# Altium schematic sheet RTC.SchDoc
size A3; SheetNumber: 16; SheetTotal: 23
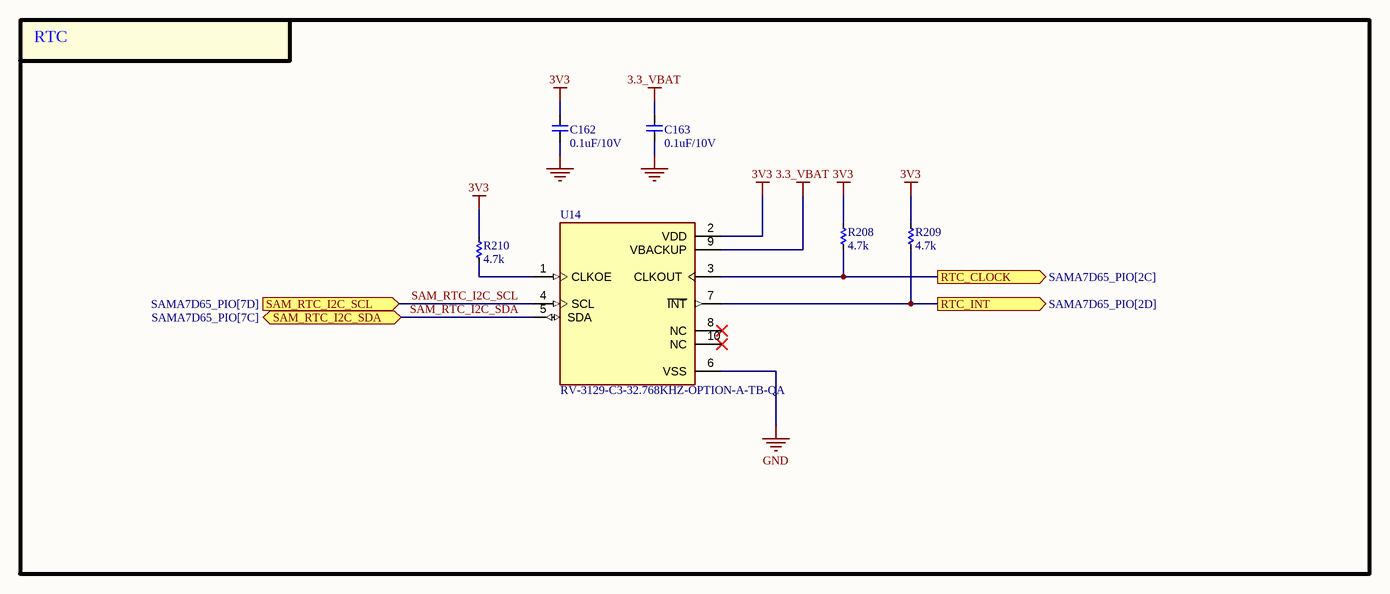
[diagram p0: RTC.SchDoc]

## Parts
C162  0.1uF/10V  [CAP_C_1005X50_L]
C163  0.1uF/10V  [CAP_C_1005X50_L]
R208  4.7k  [RES_C_1005x30_L]
R209  4.7k  [RES_C_1005x30_L]
R210  4.7k  [RES_C_1005x30_L]
U14  RV-3129-C3-32.768KHZ-OPTION-A-TB-QA  [IC_RV-3129-C3-32.768KHZ-OPTION-A-TB-QA]

## Blocks framed on the sheet
RTC: C162 C163 R208-R210 U14

## Ports
RTC_CLOCK (out, see SAMA7D65_PIO[2C]), RTC_INT (out, see SAMA7D65_PIO[2D]), SAM_RTC_I2C_SCL (in, see SAMA7D65_PIO[7D]), SAM_RTC_I2C_SDA (bidir, see SAMA7D65_PIO[7C])

## Nets
3.3_VBAT: C163.2 U14.9(VBACKUP)
3V3: C162.2 R208.1 R209.1 R210.1 U14.2(VDD)
GND: C162.1 C163.1 U14.6(VSS)
RTC_CLOCK: R208.2 U14.3(CLKOUT) ; port RTC_CLOCK
RTC_INT: R209.2 U14.7(~{INT}) ; port RTC_INT
SAM_RTC_I2C_SCL: U14.4(SCL) ; port SAM_RTC_I2C_SCL
SAM_RTC_I2C_SDA: U14.5(SDA) ; port SAM_RTC_I2C_SDA
NetR210_2: R210.2 U14.1(CLKOE)

Not connected (* = marked no-connect by the designer): U14 8(NC)* 10(NC)*

## Notes on the sheet
- Project:
- Page Contents:
- Revision:
- Design:
- Date:
- Size:
- A3
- Document Number:
- Sheet:
- of

## Library data of the parts
C162 C163 = _CAP_C_2: CAP CHIP
R208-R210 = _RES_B_2: RES
U14 = RV-3129-C3-32.768KHZ-OPTION-A-TB-QA: Real-Time Clock Module with I2C-Bus; MP: RV-3129-C3-32.768KHZ-OPTION-A-TB-QA; Value: *; Price: None; Package: None; Availability: Unavailable